# Altium schematic sheet SCB_Connectors.SchDoc
size A3
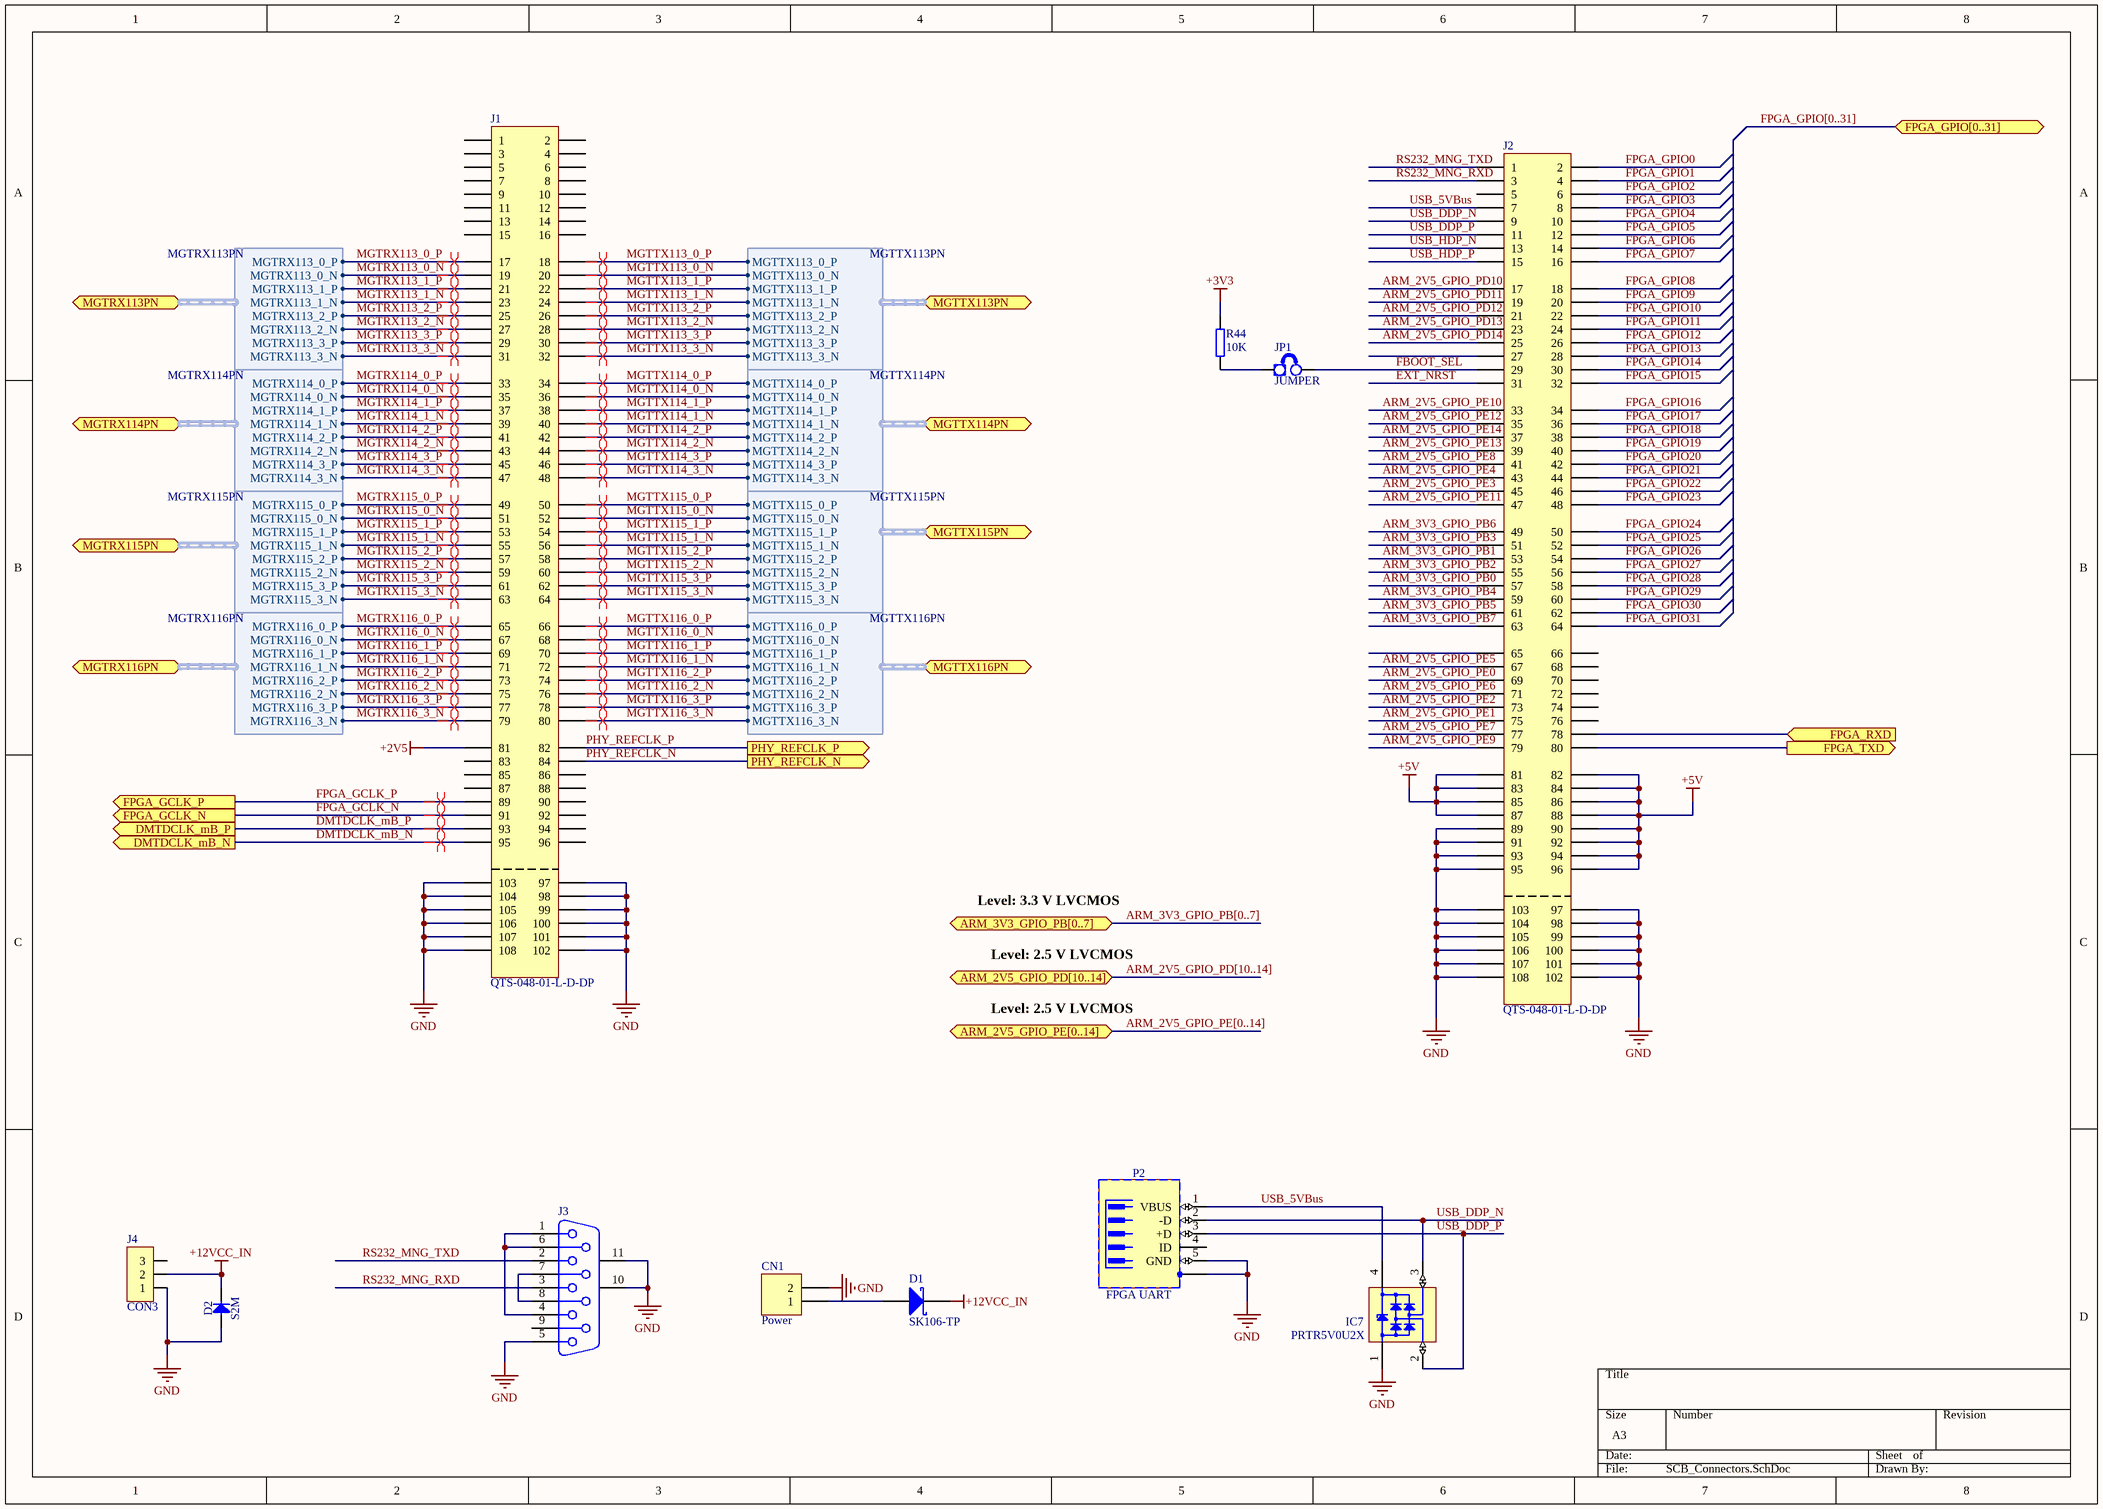
[diagram p0: SCB_Connectors.SchDoc]

## Parts
CN1  Power  [TYCO_794120_1]
D1  SK106-TP  [DIOM7959X262N]
D2  S2M  [DO-214AA/SMB]
IC7  PRTR5V0U2X  [SOT190P230X110-4N]
J1  QTS-048-01-L-D-DP  [QTS-048-XX-X-D-DP-A]
J2  QTS-048-01-L-D-DP  [QTS-048-XX-X-D-DP-A]
J3  D Connector 9  [DSUB1.385-2H9]  (value not drawn)
J4  CON3  [MOLEX_22-11-2032]
JP1  JUMPER  [con_1x2_1.27]
P2  FPGA UART  [TYCO_1734035-1]
R44  10K  [0603]

## Ports
ARM_2V5_GPIO_PD[10..14] (bidir), ARM_2V5_GPIO_PE[0..14] (bidir), ARM_3V3_GPIO_PB[0..7] (bidir), DMTDCLK_mB_N (out), DMTDCLK_mB_P (out), FPGA_GCLK_N (out), FPGA_GCLK_P (out), FPGA_GPIO[0..31] (bidir), FPGA_RXD (in), FPGA_TXD (out), MGTRX113PN (harness MGTRX113PN), MGTRX114PN (harness MGTRX114PN), MGTRX115PN (harness MGTRX115PN), MGTRX116PN (harness MGTRX116PN), MGTTX113PN (harness MGTTX113PN), MGTTX114PN (harness MGTTX114PN), MGTTX115PN (harness MGTTX115PN), MGTTX116PN (harness MGTTX116PN), PHY_REFCLK_N (out), PHY_REFCLK_P (out)

## Harnesses
MGTRX113PN: MGTRX113_0_P, MGTRX113_0_N, MGTRX113_1_P, MGTRX113_1_N, MGTRX113_2_P, MGTRX113_2_N, MGTRX113_3_P, MGTRX113_3_N
MGTRX114PN: MGTRX114_0_P, MGTRX114_0_N, MGTRX114_1_P, MGTRX114_1_N, MGTRX114_2_P, MGTRX114_2_N, MGTRX114_3_P, MGTRX114_3_N
MGTRX115PN: MGTRX115_0_P, MGTRX115_0_N, MGTRX115_1_P, MGTRX115_1_N, MGTRX115_2_P, MGTRX115_2_N, MGTRX115_3_P, MGTRX115_3_N
MGTRX116PN: MGTRX116_0_P, MGTRX116_0_N, MGTRX116_1_P, MGTRX116_1_N, MGTRX116_2_P, MGTRX116_2_N, MGTRX116_3_P, MGTRX116_3_N
MGTTX113PN: MGTTX113_0_P, MGTTX113_0_N, MGTTX113_1_P, MGTTX113_1_N, MGTTX113_2_P, MGTTX113_2_N, MGTTX113_3_P, MGTTX113_3_N
MGTTX114PN: MGTTX114_0_P, MGTTX114_0_N, MGTTX114_1_P, MGTTX114_1_N, MGTTX114_2_P, MGTTX114_2_N, MGTTX114_3_P, MGTTX114_3_N
MGTTX115PN: MGTTX115_0_P, MGTTX115_0_N, MGTTX115_1_P, MGTTX115_1_N, MGTTX115_2_P, MGTTX115_2_N, MGTTX115_3_P, MGTTX115_3_N
MGTTX116PN: MGTTX116_0_P, MGTTX116_0_N, MGTTX116_1_P, MGTTX116_1_N, MGTTX116_2_P, MGTTX116_2_N, MGTTX116_3_P, MGTTX116_3_N

## Nets
+2V5: J1.81
+3V3: R44.2
+5V: J2.81 J2.82 J2.83 J2.84 J2.85 J2.86 J2.87 J2.88 J2.90 J2.92 J2.94 J2.96
+12VCC_IN: D1.2(K) D2.1(C) J4.2
GND: CN1.2 D2.2(A) IC7.1(GND) J1.97 J1.98 J1.99 J1.100 J1.101 J1.102 J1.103 J1.104 J1.105 J1.106 J1.107 J1.108 J2.89 J2.91 J2.93 J2.95 J2.97 J2.98 J2.99 J2.100 J2.101 J2.102 J2.103 J2.104 J2.105 J2.106 J2.107 J2.108 J3.5 J3.10(MH1) J3.11(MH2) J4.1 P2.5(GND) P2.6(SH)
ARM_2V5_GPIO_PD10: J2.17
ARM_2V5_GPIO_PD11: J2.19
ARM_2V5_GPIO_PD12: J2.21
ARM_2V5_GPIO_PD13: J2.23
ARM_2V5_GPIO_PD14: J2.25
ARM_2V5_GPIO_PE0: J2.69
ARM_2V5_GPIO_PE1: J2.75
ARM_2V5_GPIO_PE2: J2.73
ARM_2V5_GPIO_PE3: J2.45
ARM_2V5_GPIO_PE4: J2.43
ARM_2V5_GPIO_PE5: J2.67
ARM_2V5_GPIO_PE6: J2.71
ARM_2V5_GPIO_PE7: J2.77
ARM_2V5_GPIO_PE8: J2.41
ARM_2V5_GPIO_PE9: J2.79
ARM_2V5_GPIO_PE10: J2.33
ARM_2V5_GPIO_PE11: J2.47
ARM_2V5_GPIO_PE12: J2.35
ARM_2V5_GPIO_PE13: J2.39
ARM_2V5_GPIO_PE14: J2.37
ARM_3V3_GPIO_PB0: J2.57
ARM_3V3_GPIO_PB1: J2.53
ARM_3V3_GPIO_PB2: J2.55
ARM_3V3_GPIO_PB3: J2.51
ARM_3V3_GPIO_PB4: J2.59
ARM_3V3_GPIO_PB5: J2.61
ARM_3V3_GPIO_PB6: J2.49
ARM_3V3_GPIO_PB7: J2.63
DMTDCLK_mB_N: J1.95 ; port DMTDCLK_mB_N
DMTDCLK_mB_P: J1.93 ; port DMTDCLK_mB_P
EXT_NRST: J2.31
FBOOT_SEL: J2.29 JP1.2(E2)
FPGA_GCLK_N: J1.91 ; port FPGA_GCLK_N
FPGA_GCLK_P: J1.89 ; port FPGA_GCLK_P
FPGA_GPIO0: J2.2
FPGA_GPIO1: J2.4
FPGA_GPIO2: J2.6
FPGA_GPIO3: J2.8
FPGA_GPIO4: J2.10
FPGA_GPIO5: J2.12
FPGA_GPIO6: J2.14
FPGA_GPIO7: J2.16
FPGA_GPIO8: J2.18
FPGA_GPIO9: J2.20
FPGA_GPIO10: J2.22
FPGA_GPIO11: J2.24
FPGA_GPIO12: J2.26
FPGA_GPIO13: J2.28
FPGA_GPIO14: J2.30
FPGA_GPIO15: J2.32
FPGA_GPIO16: J2.34
FPGA_GPIO17: J2.36
FPGA_GPIO18: J2.38
FPGA_GPIO19: J2.40
FPGA_GPIO20: J2.42
FPGA_GPIO21: J2.44
FPGA_GPIO22: J2.46
FPGA_GPIO23: J2.48
FPGA_GPIO24: J2.50
FPGA_GPIO25: J2.52
FPGA_GPIO26: J2.54
FPGA_GPIO27: J2.56
FPGA_GPIO28: J2.58
FPGA_GPIO29: J2.60
FPGA_GPIO30: J2.62
FPGA_GPIO31: J2.64
FPGA_RXD: J2.78 ; port FPGA_RXD
FPGA_TXD: J2.80 ; port FPGA_TXD
MGTRX113_0_N: J1.19 ; port MGTRX113PN.MGTRX113_0_N
MGTRX113_0_P: J1.17 ; port MGTRX113PN.MGTRX113_0_P
MGTRX113_1_N: J1.23 ; port MGTRX113PN.MGTRX113_1_N
MGTRX113_1_P: J1.21 ; port MGTRX113PN.MGTRX113_1_P
MGTRX113_2_N: J1.27 ; port MGTRX113PN.MGTRX113_2_N
MGTRX113_2_P: J1.25 ; port MGTRX113PN.MGTRX113_2_P
MGTRX113_3_N: J1.31 ; port MGTRX113PN.MGTRX113_3_N
MGTRX113_3_P: J1.29 ; port MGTRX113PN.MGTRX113_3_P
MGTRX114_0_N: J1.35 ; port MGTRX114PN.MGTRX114_0_N
MGTRX114_0_P: J1.33 ; port MGTRX114PN.MGTRX114_0_P
MGTRX114_1_N: J1.39 ; port MGTRX114PN.MGTRX114_1_N
MGTRX114_1_P: J1.37 ; port MGTRX114PN.MGTRX114_1_P
MGTRX114_2_N: J1.43 ; port MGTRX114PN.MGTRX114_2_N
MGTRX114_2_P: J1.41 ; port MGTRX114PN.MGTRX114_2_P
MGTRX114_3_N: J1.47 ; port MGTRX114PN.MGTRX114_3_N
MGTRX114_3_P: J1.45 ; port MGTRX114PN.MGTRX114_3_P
MGTRX115_0_N: J1.51 ; port MGTRX115PN.MGTRX115_0_N
MGTRX115_0_P: J1.49 ; port MGTRX115PN.MGTRX115_0_P
MGTRX115_1_N: J1.55 ; port MGTRX115PN.MGTRX115_1_N
MGTRX115_1_P: J1.53 ; port MGTRX115PN.MGTRX115_1_P
MGTRX115_2_N: J1.59 ; port MGTRX115PN.MGTRX115_2_N
MGTRX115_2_P: J1.57 ; port MGTRX115PN.MGTRX115_2_P
MGTRX115_3_N: J1.63 ; port MGTRX115PN.MGTRX115_3_N
MGTRX115_3_P: J1.61 ; port MGTRX115PN.MGTRX115_3_P
MGTRX116_0_N: J1.67 ; port MGTRX116PN.MGTRX116_0_N
MGTRX116_0_P: J1.65 ; port MGTRX116PN.MGTRX116_0_P
MGTRX116_1_N: J1.71 ; port MGTRX116PN.MGTRX116_1_N
MGTRX116_1_P: J1.69 ; port MGTRX116PN.MGTRX116_1_P
MGTRX116_2_N: J1.75 ; port MGTRX116PN.MGTRX116_2_N
MGTRX116_2_P: J1.73 ; port MGTRX116PN.MGTRX116_2_P
MGTRX116_3_N: J1.79 ; port MGTRX116PN.MGTRX116_3_N
MGTRX116_3_P: J1.77 ; port MGTRX116PN.MGTRX116_3_P
MGTTX113_0_N: J1.20 ; port MGTTX113PN.MGTTX113_0_N
MGTTX113_0_P: J1.18 ; port MGTTX113PN.MGTTX113_0_P
MGTTX113_1_N: J1.24 ; port MGTTX113PN.MGTTX113_1_N
MGTTX113_1_P: J1.22 ; port MGTTX113PN.MGTTX113_1_P
MGTTX113_2_N: J1.28 ; port MGTTX113PN.MGTTX113_2_N
MGTTX113_2_P: J1.26 ; port MGTTX113PN.MGTTX113_2_P
MGTTX113_3_N: J1.32 ; port MGTTX113PN.MGTTX113_3_N
MGTTX113_3_P: J1.30 ; port MGTTX113PN.MGTTX113_3_P
MGTTX114_0_N: J1.36 ; port MGTTX114PN.MGTTX114_0_N
MGTTX114_0_P: J1.34 ; port MGTTX114PN.MGTTX114_0_P
MGTTX114_1_N: J1.40 ; port MGTTX114PN.MGTTX114_1_N
MGTTX114_1_P: J1.38 ; port MGTTX114PN.MGTTX114_1_P
MGTTX114_2_N: J1.44 ; port MGTTX114PN.MGTTX114_2_N
MGTTX114_2_P: J1.42 ; port MGTTX114PN.MGTTX114_2_P
MGTTX114_3_N: J1.48 ; port MGTTX114PN.MGTTX114_3_N
MGTTX114_3_P: J1.46 ; port MGTTX114PN.MGTTX114_3_P
MGTTX115_0_N: J1.52 ; port MGTTX115PN.MGTTX115_0_N
MGTTX115_0_P: J1.50 ; port MGTTX115PN.MGTTX115_0_P
MGTTX115_1_N: J1.56 ; port MGTTX115PN.MGTTX115_1_N
MGTTX115_1_P: J1.54 ; port MGTTX115PN.MGTTX115_1_P
MGTTX115_2_N: J1.60 ; port MGTTX115PN.MGTTX115_2_N
MGTTX115_2_P: J1.58 ; port MGTTX115PN.MGTTX115_2_P
MGTTX115_3_N: J1.64 ; port MGTTX115PN.MGTTX115_3_N
MGTTX115_3_P: J1.62 ; port MGTTX115PN.MGTTX115_3_P
MGTTX116_0_N: J1.68 ; port MGTTX116PN.MGTTX116_0_N
MGTTX116_0_P: J1.66 ; port MGTTX116PN.MGTTX116_0_P
MGTTX116_1_N: J1.72 ; port MGTTX116PN.MGTTX116_1_N
MGTTX116_1_P: J1.70 ; port MGTTX116PN.MGTTX116_1_P
MGTTX116_2_N: J1.76 ; port MGTTX116PN.MGTTX116_2_N
MGTTX116_2_P: J1.74 ; port MGTTX116PN.MGTTX116_2_P
MGTTX116_3_N: J1.80 ; port MGTTX116PN.MGTTX116_3_N
MGTTX116_3_P: J1.78 ; port MGTTX116PN.MGTTX116_3_P
PHY_REFCLK_N: J1.84 ; port PHY_REFCLK_N
PHY_REFCLK_P: J1.82 ; port PHY_REFCLK_P
RS232_MNG_RXD: J2.3 J3.3
RS232_MNG_TXD: J2.1 J3.2
USB_5VBus: IC7.4(VCC) J2.7 P2.1(VBUS)
USB_DDP_N: IC7.3(I/O2) J2.9 P2.2(-D)
USB_DDP_P: IC7.2(I/O1) J2.11 P2.3(+D)
USB_HDP_N: J2.13
USB_HDP_P: J2.15
NetCN1_1: CN1.1 D1.1(A)
NetJ3_1: J3.1 J3.4 J3.6
NetJ3_7: J3.7 J3.8
NetJP1_1: JP1.1(E1) R44.1

Not connected (* = marked no-connect by the designer): J1 1 2 3 4 5 6 7 8 9 10 11 12 13 14 15 16 83 85 86 87 88 90 92 94 96; J2 5 27 65 66 68 70 72 74 76; J3 9; J4 3; P2 4(ID)

## Buses and harness runs
bus ARM_2V5_GPIO_PD[10..14] = port ARM_2V5_GPIO_PD[10..14]
bus ARM_2V5_GPIO_PE[0..14] = port ARM_2V5_GPIO_PE[0..14]
bus ARM_3V3_GPIO_PB[0..7] = port ARM_3V3_GPIO_PB[0..7]
bus FPGA_GPIO[0..31] = port FPGA_GPIO[0..31]

## Layout directives
differential pair: DMTDCLK_mB_N, DMTDCLK_mB_P, FPGA_GCLK_N, FPGA_GCLK_P, MGTRX113_0_N, MGTRX113_0_P, MGTRX113_1_N, MGTRX113_1_P, MGTRX113_2_N, MGTRX113_2_P, MGTRX113_3_N, MGTRX113_3_P, MGTRX114_0_N, MGTRX114_0_P, MGTRX114_1_N, MGTRX114_1_P, MGTRX114_2_N, MGTRX114_2_P, MGTRX114_3_N, MGTRX114_3_P, MGTRX115_0_N, MGTRX115_0_P, MGTRX115_1_N, MGTRX115_1_P, MGTRX115_2_N, MGTRX115_2_P, MGTRX115_3_N, MGTRX115_3_P, MGTRX116_0_N, MGTRX116_0_P, MGTRX116_1_N, MGTRX116_1_P, MGTRX116_2_N, MGTRX116_2_P, MGTRX116_3_N, MGTRX116_3_P, MGTTX113_0_N, MGTTX113_0_P, MGTTX113_1_N, MGTTX113_1_P, MGTTX113_2_N, MGTTX113_2_P, MGTTX113_3_N, MGTTX113_3_P, MGTTX114_0_N, MGTTX114_0_P, MGTTX114_1_N, MGTTX114_1_P, MGTTX114_2_N, MGTTX114_2_P, MGTTX114_3_N, MGTTX114_3_P, MGTTX115_0_N, MGTTX115_0_P, MGTTX115_1_N, MGTTX115_1_P, MGTTX115_2_N, MGTTX115_2_P, MGTTX115_3_N, MGTTX115_3_P, MGTTX116_0_N, MGTTX116_0_P, MGTTX116_1_N, MGTTX116_1_P, MGTTX116_2_N, MGTTX116_2_P, MGTTX116_3_N, MGTTX116_3_P

## Notes on the sheet
- Level: 3.3 V LVCMOS
- Level: 2.5 V LVCMOS

## Library data of the parts
CN1 = Header 2: Header, 2-Pin; Manufacturer1 PN: 794120-1; Manufacturer1: Tyco Electronics; LatestRevisionDate: 17-Jul-2002; LatestRevisionNote: Re-released for DXP Platform.; Publisher: Altium Limited; Distributor1: Digikey; Distributor1 PN: A25753-ND
D1 = SK106-TP: Schottky Diode 10A 60V; Manufacturer1: Micro Commercial Components; Distributor1 PN: Digikey; Manufacturer1 PN: SK106-TP; Distributor1 PN: SK106-TPCT-ND
D2 = S2M: Diode; Part Description: General Purpose Rectifiers (Glass Passivated); Manufacturer: FAIRCHILD SEMICONDUCTOR; Voltage: 1000V; Power: 2A; Table: Diodes; Part Number: S2M; Component Kind: Standard; Component Type: Standard; Device: S2M; Footprint: DIOM5336X265N; PackageDescription: DO-214-AA/SMB Diode, Molded Body; 5.34mm L X 3.625mm W X 2.65mm H, IPC Medium Density; Manufacturer Part Number: S2M; Pin Count: 2; Case: DO-214AA; Mounted: Yes; Socket: No; SMD: Yes; ComponentHeight: 2.65mm; HelpURL: \\cern.ch\dfs\Applications\Altium\Datasheets\S2M.pdf; Author: CERN DEM JLC; CreateDate: 4/26/2011; LatestRevisionDate: 4/26/2011
IC7 = PRTR5V0U2X: Ultra Low Capacitance Double Rail-to-Rail ESD Protection Diode; Part Description: Ultra Low Capacitance (1pF) Double Rail-to-Rail ESD Protection Diode (8kV); Manufacturer: PHILIPS NXP; Voltage: 5.5V; Table: Diodes; Part Number: PRTR5V0U2X; Component Kind: Standard; Component Type: Standard; Device: PRTR5V0U2X; PackageDescription: SOT143B, SOT, 1.90mm Pitch; 4 Pin, 1.30mm W X 2.90mm L X 1.10mm H body, IPC Medium Density; Manufacturer Part Number: PRTR5V0U2X; Pin Count: 4; Case: SOT143B; Mounted: Yes; Socket: No; SMD: Yes; ComponentHeight: 1.1mm; HelpURL: \\cern.ch\dfs\Applications\Altium\Datasheets\PRTR5V0U2X.pdf; Author: CERN DEM JLC; CreateDate: 3/22/2011; LatestRevisionDate: 3/22/2011
J1 J2 = QTS-048-01-L-D-DP: High Speed Ground Plane Header; Manufacturer1: Samtec; Manufacturer1 PN: QTS-048-01-L-D-DP
J3 = D Connector 9: Receptacle Assembly, 9 Position, Right Angle; Manufacturer1 PN: 1734348-1; Manufacturer1: TE Connectivity; PackageDocument: O; Positions: 9; Published: 15-Jun-2001; LatestRevisionDate: 17-Jul-2002; LatestRevisionNote: Re-released for DXP Platform.; DatasheetDocument: 1-Sep-1999; PackageReference: 788750; Publisher: Altium Limited; Orientation: Right Angle; Gender: Receptacle; Distributor1: Digikey; Distributor1 PN: A35109-ND
J4 = CON3: Connector; Manufacturer1: Molex; Distributor1: Digikey; Distributor1 PN: WM2701-ND; Manufacturer1 PN: 22-11-2032
P2 = TYCO_1734035-1: 5 Pin + 1 Shield USB Receptacle; Part Description: 5 Position, Right Angle, SMD Mini USB Type B Receptacle; Manufacturer: TYCO ELECTRONICS; Table: TYCO; Part Number: TYCO_1734035-1; Component Kind: Standard; Component Type: Standard; Pin Count: 6; Family: USB; Mounted: Yes; Socket: No; SMD: Yes; Status: None; Manufacturer Part Number: 1734035-1; ComponentHeight: 3.95mm; HelpURL: \\cern.ch\dfs\Applications\Altium\Datasheets\TYCO_1734035-1.pdf; Author: CERN DEM JLC; CreateDate: 02/05/2011; LatestRevisionDate: 02/05/2011
R44 = R0603_10K_±1%_0.2W_100PPM: SMD Resistor; Manufacturer1: Rohm; Manufacturer1 PN: ESR03EZPF1002; TCR: 100ppm; Power Rating: 0.2W; Tolerance: ±1%; Case: 0603; Distributor1: DigiKey; Distributor1 PN: RHM10KADCT-ND; Value: 10K